# Altium schematic sheet RP2040.SchDoc: Sample Sheet Title
size B; Date: MM/DD/YYYY; Author: Sample Author; Organization: ORGANIZATION; Address1: ADDRESS 1; Address2: ADDRESS 2; Address3: ADDRESS 3; Address4: ADDRESS 4; Revision: -; SheetNumber: 2; SheetTotal: 2; ENG_APP_DATE: --/--/--; DSN_APP_DATE: --/--/--; CHK_APP_DATE: --/--/--
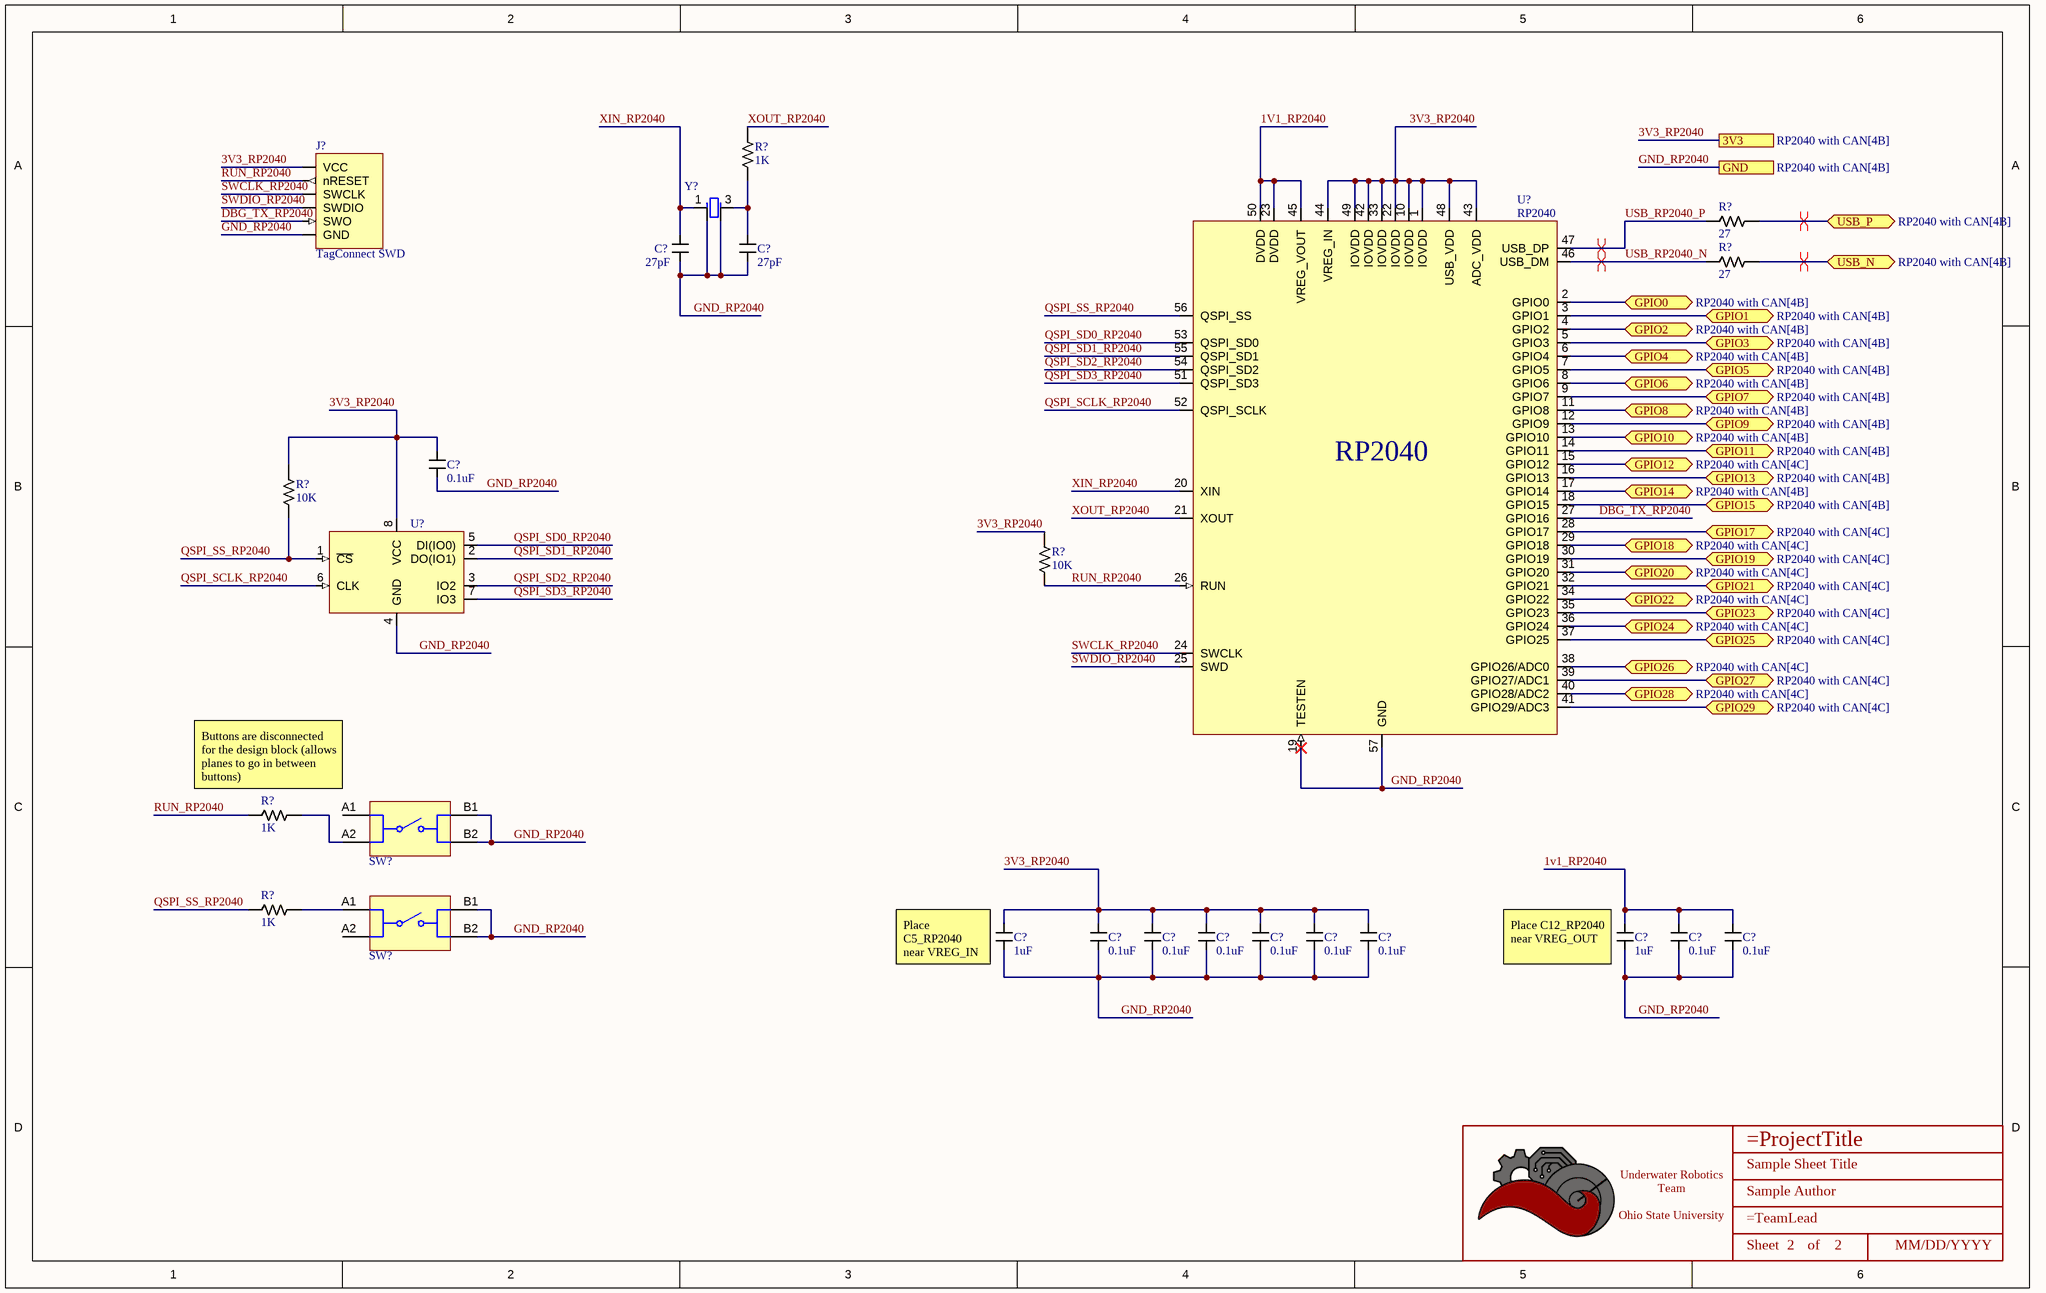
[diagram p0: RP2040.SchDoc]

## Parts
(Parts that share a designator on the sheet are numbered #1, #2 ... from top to bottom, then left to right.)
*  Title_Block  [LOGO]  (value not drawn)  (graphical)
C?#1  value 27pF  [CAPACITOR_0402]  (hidden comment: 27pF Ceramic 50V)
C?#2  value 27pF  [CAPACITOR_0402]  (hidden comment: 27pF Ceramic 50V)
C?#3  value 0.1uF  [CAPACITOR_0402]  (hidden comment: 100nF Ceramic 6.3V)
C?#4  value 1uF  [CAPACITOR_0402]  (hidden comment: 1uF Ceramic 16V)
C?#5  value 0.1uF  [CAPACITOR_0402]  (hidden comment: 100nF Ceramic 6.3V)
C?#6  value 0.1uF  [CAPACITOR_0402]  (hidden comment: 100nF Ceramic 6.3V)
C?#7  value 0.1uF  [CAPACITOR_0402]  (hidden comment: 100nF Ceramic 6.3V)
C?#8  value 0.1uF  [CAPACITOR_0402]  (hidden comment: 100nF Ceramic 6.3V)
C?#9  value 0.1uF  [CAPACITOR_0402]  (hidden comment: 100nF Ceramic 6.3V)
C?#10  value 0.1uF  [CAPACITOR_0402]  (hidden comment: 100nF Ceramic 6.3V)
C?#11  value 1uF  [CAPACITOR_0402]  (hidden comment: 1uF Ceramic 16V)
C?#12  value 0.1uF  [CAPACITOR_0402]  (hidden comment: 100nF Ceramic 6.3V)
C?#13  value 0.1uF  [CAPACITOR_0402]  (hidden comment: 100nF Ceramic 6.3V)
J?  TagConnect SWD  [TC2030-MCP]  (no BOM)
R?#1  Value  (Ohms): 1K  [RESISTOR_0402]  (hidden comment: 1k Ohm 1% 1/16W)
R?#2  Value  (Ohms): 27  [RESISTOR_0402]  (hidden comment: 27 Ohm 1% 1/16W)
R?#3  Value  (Ohms): 27  [RESISTOR_0402]  (hidden comment: 27 Ohm 1% 1/16W)
R?#4  Value  (Ohms): 10K  [RESISTOR_0402]  (hidden comment: 10k Ohm 1% 1/16W)
R?#5  Value  (Ohms): 10K  [RESISTOR_0402]  (hidden comment: 10k Ohm 1% 1/16W)
R?#6  Value  (Ohms): 1K  [RESISTOR_0402]  (hidden comment: 1k Ohm 1% 1/16W)
R?#7  Value  (Ohms): 1K  [RESISTOR_0402]  (hidden comment: 1k Ohm 1% 1/16W)
SW?#1  434123025826  [SMD_434123025826]  (value not drawn)
SW?#2  434123025826  [SMD_434123025826]  (value not drawn)
U?#1  W25Q128JVSIQ  [SOIC-8 W25QxJV]  (value not drawn)
U?#2  RP2040  [QFN-56 RP2040]
Y?  CRYSTAL 12.0000MHZ 18PF SMD  [4-SMD, NO LEAD CRYSTAL 3.2x2.5mm]  (value not drawn)

## Ports
3V3 (see RP2040 with CAN[4B]), GND (see RP2040 with CAN[4B]), GPIO0 (bidir, see RP2040 with CAN[4B]), GPIO1 (bidir, see RP2040 with CAN[4B]), GPIO2 (bidir, see RP2040 with CAN[4B]), GPIO3 (bidir, see RP2040 with CAN[4B]), GPIO4 (bidir, see RP2040 with CAN[4B]), GPIO5 (bidir, see RP2040 with CAN[4B]), GPIO6 (bidir, see RP2040 with CAN[4B]), GPIO7 (bidir, see RP2040 with CAN[4B]), GPIO8 (bidir, see RP2040 with CAN[4B]), GPIO9 (bidir, see RP2040 with CAN[4B]), GPIO10 (bidir, see RP2040 with CAN[4B]), GPIO11 (bidir, see RP2040 with CAN[4B]), GPIO12 (bidir, see RP2040 with CAN[4C]), GPIO13 (bidir, see RP2040 with CAN[4B]), GPIO14 (bidir, see RP2040 with CAN[4B]), GPIO15 (bidir, see RP2040 with CAN[4B]), GPIO17 (bidir, see RP2040 with CAN[4C]), GPIO18 (bidir, see RP2040 with CAN[4C]), GPIO19 (bidir, see RP2040 with CAN[4C]), GPIO20 (bidir, see RP2040 with CAN[4C]), GPIO21 (bidir, see RP2040 with CAN[4C]), GPIO22 (bidir, see RP2040 with CAN[4C]), GPIO23 (bidir, see RP2040 with CAN[4C]), GPIO24 (bidir, see RP2040 with CAN[4C]), GPIO25 (bidir, see RP2040 with CAN[4C]), GPIO26 (bidir, see RP2040 with CAN[4C]), GPIO27 (bidir, see RP2040 with CAN[4C]), GPIO28 (bidir, see RP2040 with CAN[4C]), GPIO29 (bidir, see RP2040 with CAN[4C]), USB_N (bidir, see RP2040 with CAN[4B]), USB_P (bidir, see RP2040 with CAN[4B])

## Nets
1V1_RP2040: C?#11.1 C?#12.1 C?#13.1 U?#2.23(DVDD) U?#2.45(VREG_VOUT) U?#2.50(DVDD)
3V3_RP2040: C?#3.1 C?#4.1 C?#5.1 C?#6.1 C?#7.1 C?#8.1 C?#9.1 C?#10.1 J?.2(VCC) R?#4.1 R?#5.1 U?#1.8(VCC) U?#2.1(IOVDD) U?#2.10(IOVDD) U?#2.22(IOVDD) U?#2.33(IOVDD) U?#2.42(IOVDD) U?#2.43(ADC_VDD) U?#2.44(VREG_IN) U?#2.48(USB_VDD) U?#2.49(IOVDD) ; port 3V3
DBG_TX_RP2040: J?.5(SWO) U?#2.27(GPIO16)
GND_RP2040: C?#1.2 C?#2.2 C?#3.2 C?#4.2 C?#5.2 C?#6.2 C?#7.2 C?#8.2 C?#9.2 C?#10.2 C?#11.2 C?#12.2 C?#13.2 J?.6(GND) SW?#1.B1 SW?#1.B2 SW?#2.B1 SW?#2.B2 U?#1.4(GND) U?#2.19(TESTEN) U?#2.57(GND) Y?.2(GND1) Y?.4(GND1) ; port GND
GPIO0: U?#2.2(GPIO0) ; port GPIO0
GPIO1: U?#2.3(GPIO1) ; port GPIO1
GPIO2: U?#2.4(GPIO2) ; port GPIO2
GPIO3: U?#2.5(GPIO3) ; port GPIO3
GPIO4: U?#2.6(GPIO4) ; port GPIO4
GPIO5: U?#2.7(GPIO5) ; port GPIO5
GPIO6: U?#2.8(GPIO6) ; port GPIO6
GPIO7: U?#2.9(GPIO7) ; port GPIO7
GPIO8: U?#2.11(GPIO8) ; port GPIO8
GPIO9: U?#2.12(GPIO9) ; port GPIO9
GPIO10: U?#2.13(GPIO10) ; port GPIO10
GPIO11: U?#2.14(GPIO11) ; port GPIO11
GPIO12: U?#2.15(GPIO12) ; port GPIO12
GPIO13: U?#2.16(GPIO13) ; port GPIO13
GPIO14: U?#2.17(GPIO14) ; port GPIO14
GPIO15: U?#2.18(GPIO15) ; port GPIO15
GPIO17: U?#2.28(GPIO17) ; port GPIO17
GPIO18: U?#2.29(GPIO18) ; port GPIO18
GPIO19: U?#2.30(GPIO19) ; port GPIO19
GPIO20: U?#2.31(GPIO20) ; port GPIO20
GPIO21: U?#2.32(GPIO21) ; port GPIO21
GPIO22: U?#2.34(GPIO22) ; port GPIO22
GPIO23: U?#2.35(GPIO23) ; port GPIO23
GPIO24: U?#2.36(GPIO24) ; port GPIO24
GPIO25: U?#2.37(GPIO25) ; port GPIO25
GPIO26: U?#2.38(GPIO26/ADC0) ; port GPIO26
GPIO27: U?#2.39(GPIO27/ADC1) ; port GPIO27
GPIO28: U?#2.40(GPIO28/ADC2) ; port GPIO28
GPIO29: U?#2.41(GPIO29/ADC3) ; port GPIO29
QSPI_SCLK_RP2040: U?#1.6(CLK) U?#2.52(QSPI_SCLK)
QSPI_SD0_RP2040: U?#1.5(DI(IO0)) U?#2.53(QSPI_SD0)
QSPI_SD1_RP2040: U?#1.2(DO(IO1)) U?#2.55(QSPI_SD1)
QSPI_SD2_RP2040: U?#1.3(IO2) U?#2.54(QSPI_SD2)
QSPI_SD3_RP2040: U?#1.7(IO3) U?#2.51(QSPI_SD3)
QSPI_SS_RP2040: R?#4.2 R?#7.2 U?#1.1(~{CS}) U?#2.56(QSPI_SS)
RUN_RP2040: J?.4(nRESET) R?#5.2 R?#6.2 U?#2.26(RUN)
SWCLK_RP2040: J?.3(SWCLK) U?#2.24(SWCLK)
SWDIO_RP2040: J?.1(SWDIO) U?#2.25(SWD)
USB_N: R?#3.1 ; port USB_N
USB_P: R?#2.1 ; port USB_P
USB_RP2040_N: R?#3.2 U?#2.46(USB_DM)
USB_RP2040_P: R?#2.2 U?#2.47(USB_DP)
XIN_RP2040: C?#1.1 U?#2.20(XIN) Y?.1
XOUT_RP2040: R?#1.1 U?#2.21(XOUT)
NetC?#2_1: C?#2.1 R?#1.2 Y?.3
NetR?#6_1: R?#6.1 SW?#1.A2
NetR?#7_1: R?#7.1 SW?#2.A1

Not connected (* = marked no-connect by the designer): SW?#1 A1; SW?#2 A2

## Layout directives
differential pair; differential pair class USB 2.0: USB_N, USB_P, USB_RP2040_N, USB_RP2040_P

## Notes on the sheet
- Buttons are disconnected for the design block (allows planes to go in between buttons)
- (near C?#4) Place C5_RP2040 near VREG_IN
- (near C?#11) Place C12_RP2040 near VREG_OUT
- DWG. NO.
- REV.
- SHT.
- THIS DOCUMENT AND THE DATA DISCLOSED HEREIN OR HEREWITH IS THE PROPERTY OF ALTIUM LIMITED AND MAY BE FREELY DISTRIBUTED IN WHOLE. NO RIGHTS ARE RESERVED OR EXPRESS OR IMPLIED WARANTEE GIVEN.
- REVISION
- DESCRIPTION
- DATE
- APPROVED
- ENG:
- APPROVALS
- PROJECT
- DSN:
- CHK:
- REFERENCE DOCUMENTS
- PROJECT REVISION:
- TITLE
- DOCUMENT REVISION:
- DESIGN ITEM:
- BOM:
- FAB DWG:
- PCB DWG:
- ASSY DWG:
- SCALE:
- SIZE
- B
- CAGE CODE
- FILE NAME
- DWG NO.
- SHEET
- OF
- REV
- (in symbol Title_Block) Underwater Robotics Team / Ohio State University; Sheet; of

## Library data of the parts
* = Title_Block: UWRT Schematic Title Block Template / Created June 2021, Dylan Trainor
C?#1 C?#2 = CAPACITOR_0.000027uF_0402: Cap 27pF 50V +/-5% / Ceramic 0402; Made By: Robert Pafford; Tolerance: +/- 5%; Voltage: 50V; Supplier 1: Digi-Key; Supplier Part Number 1: 445-5589-1-ND
C?#3 C?#5-C?#10 C?#12 C?#13 = CAPACITOR_0.1uF_0402: Cap 100nF 25V +/-10% / Ceramic 0402; Made By: Robert Pafford; Tolerance: +/- 10%; Voltage: 25V; Supplier 1: Digi-Key; Supplier Part Number 1: 478-7868-1-ND
C?#4 C?#11 = CAPACITOR_1uF_0402: Cap 1uF 16V +/-10% / Ceramic 0402; Made By: Robert Pafford; Tolerance: +/- 10%; Voltage: 16V; Supplier 1: Digi-Key; Supplier Part Number 1: 478-0402YD105KAT4ADKR-ND
J? = TC2030_SWD: TagConnect TC2030 ARM SWD 6-pin
R?#1 R?#6 R?#7 = RESISTOR_1K_0402: RES 1k OHM 1% 1/16W 0402; Tolerance: +/- 1%; Made By: Robert Pafford; Wattage: 1/16W; Supplier: Digikey; Digikey Part Numer: CR0603-JW-104ELFTR-ND; Supplier 1: Digi-Key; Supplier Part Number 1: 13-AC0402FR-131KLCT-ND
R?#2 R?#3 = RESISTOR_27_0402: RES 27 OHM 1% 1/16W 0402; Tolerance: +/- 1%; Made By: Robert Pafford; Wattage: 1/16W; Supplier: Digikey; Digikey Part Numer: CR0603-JW-104ELFTR-ND; Supplier 1: Digi-Key; Supplier Part Number 1: YAG5278DKR-ND
R?#4 R?#5 = RESISTOR_10K_0402: RES 10k OHM 1% 1/16W 0402; Tolerance: +/- 1%; Made By: Robert Pafford; Wattage: 1/16W; Supplier: Digikey; Digikey Part Numer: CR0603-JW-104ELFTR-ND; Supplier 1: Digi-Key; Supplier Part Number 1: YAG3436CT-ND
SW?#1 SW?#2 = Tactile Switch SMD: WS-TASV J-Bend SMT Tact Switch, SPST-NO, 16VDC, 50mA, 260g; Manufacturer: Wurth Elektronik; Washable: No; ComponentLink1Description: Website Link; ComponentLink1URL: https://www.we-online.com/redexpert/article/434123025826?ad; ComponentLink2Description: Datasheet Link; ComponentLink2URL: https://www.we-online.com/redexpert/spec/434123025826?ad; Manufacturer Part Number: 434123025826; Category: Tact Switches; Match Code: WS-TASV; Mount: Surface Mount; Operating Temperature Max: 85°C; Operating Temperature Min: -40°C; Packaging: Tape and Reel; Length: 4.2mm; Width: 3.2mm; Height: 2.5mm; Circuit: SPST-NO; Contact Material: Stainless Steel; Contact Plating: Silver; Operation Force: 260g; Rated Current: 50mA; Rated Voltage: 16VDC; Terminal Material: Copper Alloy; Terminal Plating: Silver
U?#1 = W25Q128JVSIQ: IC FLASH 128MBIT SPI/QUAD 8SOIC; Made By: Robert Pafford; Supplier 1: Digi-Key; Supplier Part Number 1: W25Q128JVSIQ-ND; Size: 128M
U?#2 = RP2040: Raspberry Pi RP2040; Made By: Robert Pafford; Input Voltage: 3.3V; Crystal Frequency: 12 MHz; Number of GPIOs: 29; Available Busses: SPI, I2C, PWM, USB; ComponentLink1Description: DigiKey; ComponentLink1URL: *; ComponentLink2Description: Datasheet; ComponentLink2URL: https://datasheets.raspberrypi.org/rp2040/rp2040-datasheet.pdf
Y? = CRYSTAL_12MHz_SMD_SMALL: 12 MHz ±20ppm Crystal 18pF 100 Ohms 4-SMD, No Lead (3.2x2.5mm); Made By: Robert Pafford; Frequency: 12 MHz; Load Capacitance: 18pF; ESR: 100 Ohms; Supplier 1: Digi-Key; Supplier Part Number 1: 2151-RH100-12.000-18-2030-EXT-TRCT-ND